# EAGLE design zgrzewarka (EAGLE 8.7.0)
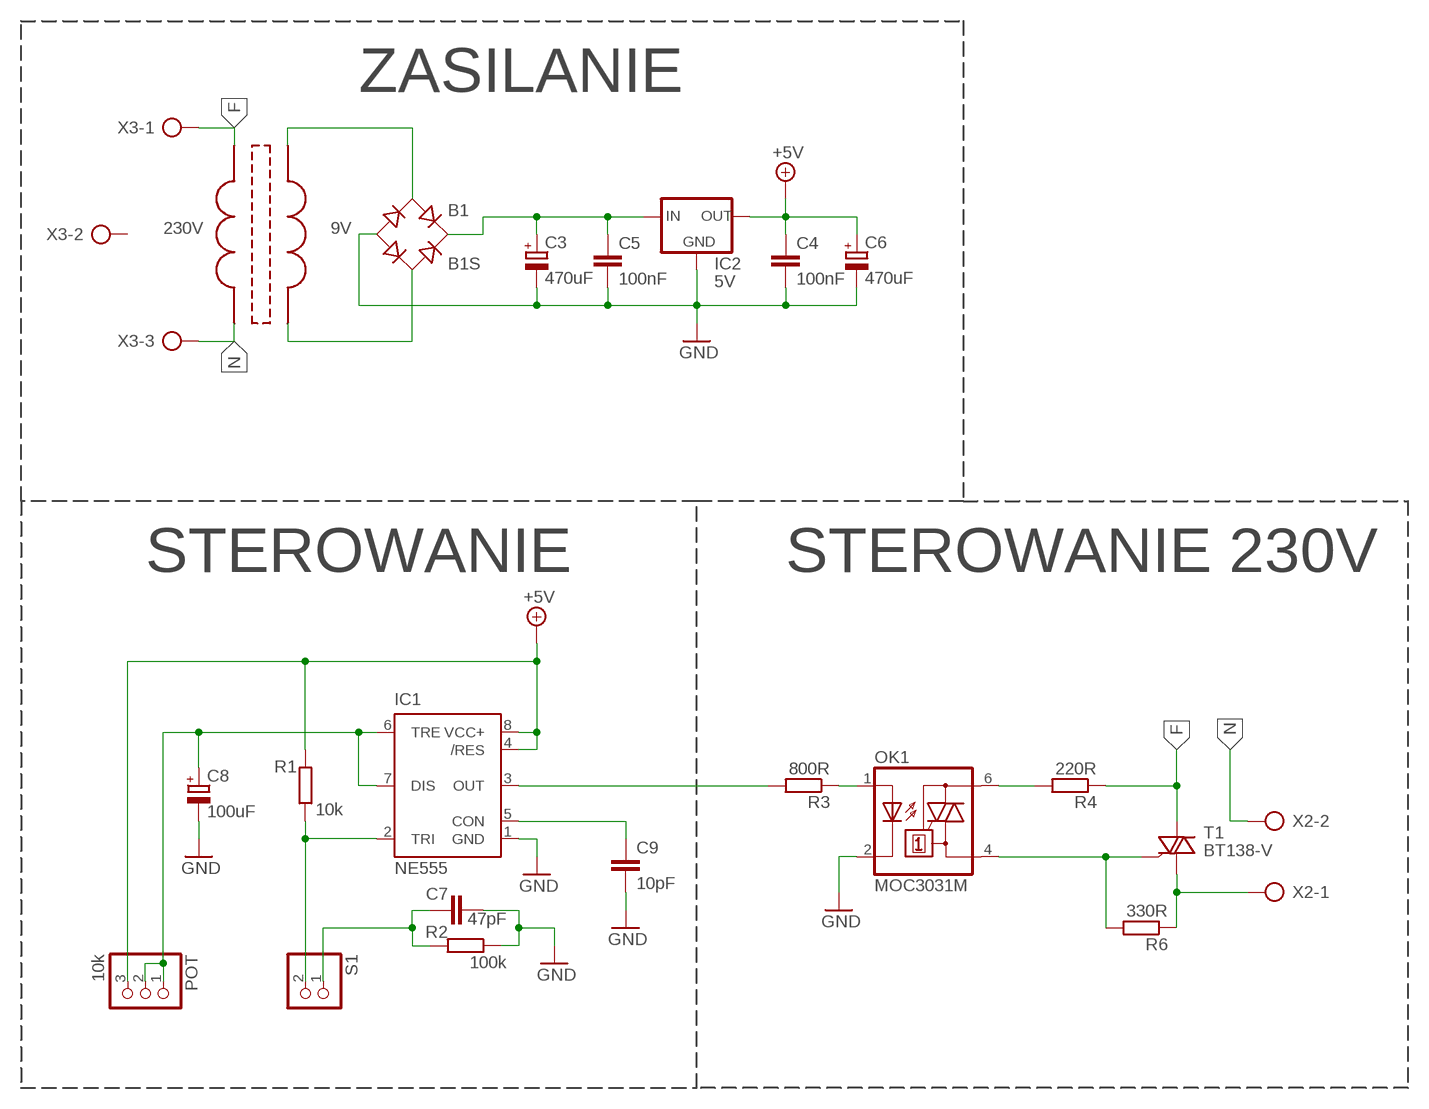
[diagram p0: schematic, sheet 1]

## Parts
B1  B1S  [MBS]
C3  470uF  C-EU-POL'''  [C5-8,5]
C4  100nF  C-EU050-045-075  [C50-45-75]
C5  100nF  C-EU050-045-075  [C50-45-75]
C6  470uF  C-EU-POL'''  [C5-8,5]
C7  47pF  C-EU050-045-075  [C50-45-75]
C8  100uF  C-EU-POL'''  [C5-8,5]
C9  10pF  C-EU050-045-075  [C50-45-75]
IC1  NE555  [DIL-08]
IC2  5V  78LXX  [78LXX]
OK1  MOC3031M  [DIL06]
POT  10k  PINHD-1X3  [1X03]
R1  10k  R-EU7  [204/7]
R2  100k  R-EU7  [204/7]
R3  800R  R-EU7  [204/7]
R4  220R  R-EU7  [204/7]
R6  330R  R-EU7  [204/7]
S1  PINHD-1X2  [1X02]
T1  BT138-V  [TO220BV]
U$1  TRAFO-9V  [OBUDOWA1]
X2  AK300/2  [AK300/2]
X3  AK300/3  [AK300/3]

## Nets
+5V: C4.P$1 C6.+ IC1.4(/RES) IC1.8(VCC+) IC2.OUT POT.3 R1.P$2
F: R4.P$1 T1.T2(A2) U$1.230V-1 X3.1
GND: B1.- C3.- C4.P$2 C5.P$2 C6.- C7.P$2 C8.- C9.P$2 IC1.1(GND) IC2.GND OK1.2(C) R2.P$1
N: U$1.230V-2 X2.2 X3.3
N$3: B1.AC1 U$1.9V-1
N$4: B1.AC2 U$1.9V-2
N$5: C9.P$1 IC1.5(CON)
N$6: B1.+ C3.+ C5.P$1 IC2.IN
N$7: IC1.2(TRI) R1.P$1 S1.2
N$8: IC1.3(OUT) R3.P$2
N$9: C7.P$1 R2.P$2 S1.1
N$10: OK1.1(A) R3.P$1
N$12: C8.+ IC1.6(TRE) IC1.7(DIS) POT.1 POT.2
N$13: OK1.6(A2) R4.P$2
N$14: OK1.4(A1) R6.P$2 T1.G
N$16: R6.P$1 T1.T1(A1) X2.1
Unconnected: X3.2

## Notes on the sheet
- ZASILANIE
- STEROWANIE | STEROWANIE 230V

## Library data of the parts
B1 = rectifier:B*S: Surface Mount Glass Passivated Bridge Rectifiers Source: Comchip Bridge Rectifiers B05S-G_B10S-G.pdf
C3 C6 C8 = RCL!:C-EU-POL
C4 C5 C7 C9 = RCL!:C-EU
IC1 = st-microelectronics:NE555: General purpose bipolar Timer; MF: Arrow Electronics; MPN: NE555N; OC_FARNELL: 1467742; OC_NEWARK: 89K1486
IC2 = v-reg:78LXX: VOLTAGE REGULATOR
OK1 = optocoupler:MOC30*: 6-Pin DIP Zero-Cross Optoisolators Triac Driver Output (250/400 Volt Peak) Source: Data sheet <http://www.fairchildsemi.com/ds/MO/MOC3031M.pdf> The old path of data sheet not more available 2013-05-06.; MF: FAIRCHILD SEMICONDUCTOR; MPN: MOC3031M; OC_FARNELL: 9875964; OC_NEWARK: 78K6089
POT = pinhead:PINHD-1X3: PIN HEADER
R1-R4 R6 = RCL!:R-EU
S1 = pinhead:PINHD-1X2: PIN HEADER
T1 = triac:BT138: TRIAC Source: http://www.semiconductors.philips.com BT138_SERIES_2.pdf
U$1 = trafo:TRAFO-9V
X2 = con-ptr500:AK300/2: CONNECTOR; OC_FARNELL: unknown; OC_NEWARK: unknown
X3 = con-ptr500:AK300/3: CONNECTOR; OC_FARNELL: unknown; OC_NEWARK: unknown

## Board
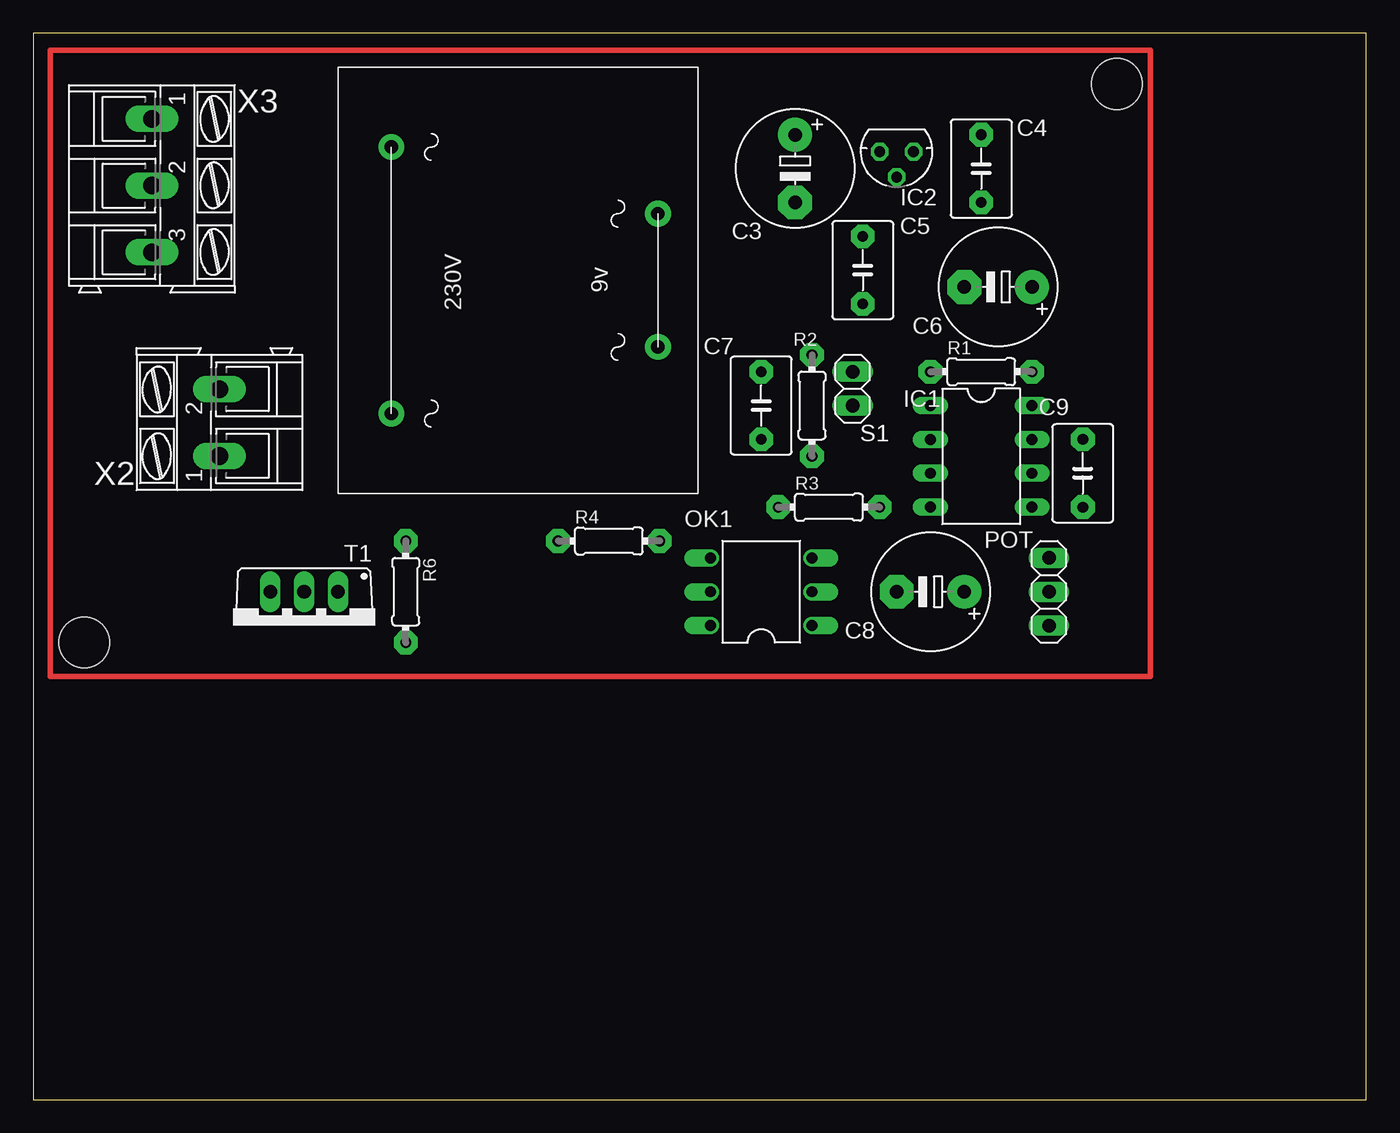
[diagram p1: board, top side]
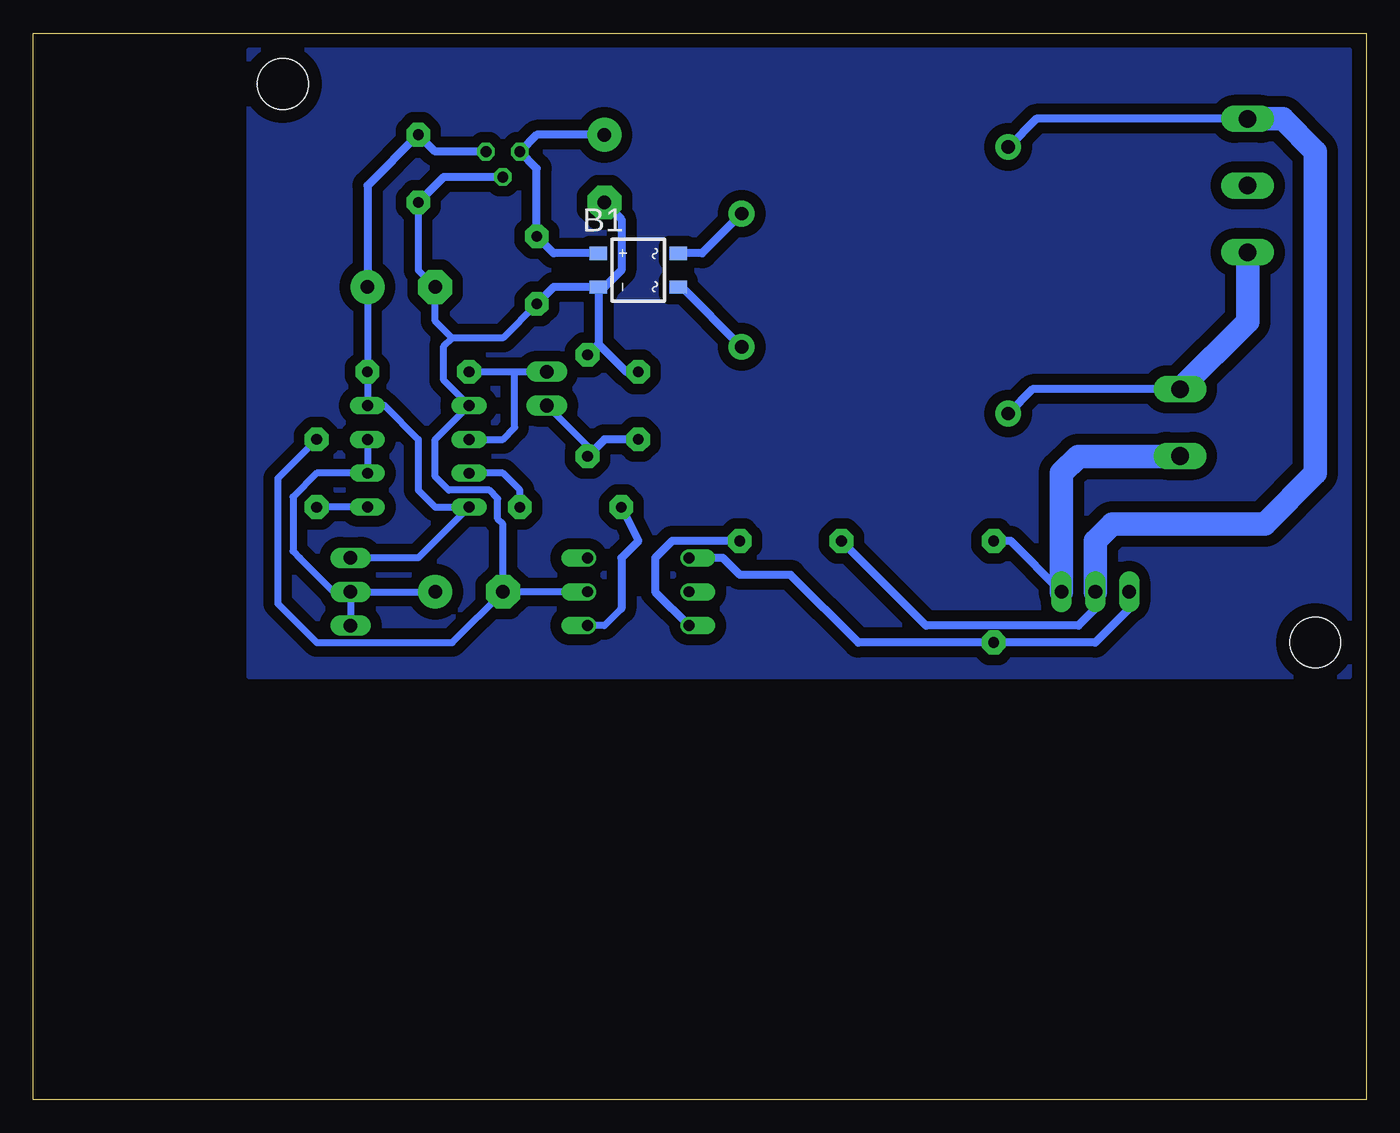
[diagram p2: board, bottom side, seen from below]

Size 100 x 80 mm. Coordinates in mm from the lower left corner, seen from the top.
Outline: 0,0 100,0 100,80 0,80 0,0
Copper layers (1*16): Top 0.035mm / dielectric 1.5mm / Bottom 0.035mm
Design rules "default": minimum track width 6mil, minimum drill 0.35mm, track to track 6mil, track to pad 6mil, pad to pad 6mil, via to via 6mil, smd to smd 6mil, copper to edge 40mil, drill to drill 6mil, minimum pad ring 10mil, minimum via ring 8mil, stop-mask expansion 4mil, vias tented up to drill 0mil, thermal gap 10mil
Holes 3.81 mm at 3.81,34.29 81.28,76.2

### Footprints (pad centres in the part's own frame; a part is rotated, then mirrored left to right if it is on the bottom)
MBS = smd 1 x 1.3: + -1.27,-3; - 1.27,-3; AC1 -1.27,3; AC2 1.27,3
C5-8,5 = drill 1.016 pad 2.54: + -2.54,0 | drill 1.016 pad 2.54 octagon: - 2.54,0
C50-45-75 = drill 0.8 pad 1.778 octagon: P$1 -2.54,0; P$2 2.54,0
DIL-08 = drill 0.813 long: 1 -3.81,-3.81; 2 -1.27,-3.81; 3 1.27,-3.81; 4 3.81,-3.81; 5 3.81,3.81; 6 1.27,3.81; 7 -1.27,3.81; 8 -3.81,3.81
78LXX = drill 0.813 octagon: GND 0,1.905; IN 1.27,0; OUT -1.27,0
DIL06 = drill 0.813 offset: 1 -2.54,-3.81; 2 0,-3.81; 3 2.54,-3.81; 4 2.54,3.81; 5 0,3.81; 6 -2.54,3.81
1X03 = drill 1.016 long: 1 -2.54,0; 2 0,0; 3 2.54,0
204/7 = drill 0.8 pad 1.778 octagon: P$1 -3.81,0; P$2 3.81,0
1X02 = drill 1.016 long: 1 -1.27,0; 2 1.27,0
TO220BV = drill 1.016 long: G 2.54,-2.54; T1 -2.54,-2.54; T2 0,-2.54
OBUDOWA1 = drill 1 pad 1.93: 9V-1 11,24; 9V-2 21,24; 230V-1 6,4; 230V-2 26,4
AK300/2 = drill 1.321 long: 1 -2.515,0; 2 2.489,0
AK300/3 = drill 1.321 long: 1 -5.004,0; 2 0,0; 3 5.004,0

### Placement (x,y rotation side)
B1  54.61,62.23 270 bottom
C3  57.15,69.85 270 top
C4  71.12,69.85 270 top
C5  62.23,62.23 270 top
C6  72.39,60.96 180 top
C7  54.61,52.07 90 top
C8  67.31,38.1 180 top
C9  78.74,46.99 90 top
IC1  71.12,48.26 270 top
IC2  64.77,71.12 180 top
OK1  54.61,38.1 90 top
POT  76.2,38.1 90 top
R1  71.12,54.61 0 top
R2  58.42,52.07 270 top
R3  59.69,44.45 0 top
R4  43.18,41.91 0 top
R6  27.94,38.1 270 top
S1  61.47,53.34 90 top
T1  20.32,35.56 180 top
U$1  22.86,77.47 270 top
X2  13.97,50.8 90 top
X3  8.89,68.58 270 top

### Tracks (layer width: path | path; a pad name or v marks a point on that pad's centre or on a via)
+5V
  Bottom 0.508: C6.+ R1.P$2 IC1.8 73.66,52.07 71.12,49.53 71.12,45.72 69.85,44.45 IC1.4 71.12,40.64 POT.3
  Bottom 0.61: IC2.OUT 69.85,71.12 C4.P$1 74.93,68.58 C6.+
F
  Bottom 0.61: X3.1 24.75,73.58 U$1.230V-1 | T1.T2 20.32,36.83 21.59,35.56 33.02,35.56 R4.P$1
  Bottom 1.778: X3.1 6.27,73.58 3.81,71.12 3.81,46.99 7.62,43.18 19.05,43.18 20.32,41.91 T1.T2
GND
  Bottom 0.508: C5.P$2 64.77,57.15 68.58,57.15 | C4.P$2 71.12,62.23 C6.- 69.85,58.42 68.58,57.15 | OK1.2 C8.- | C8.- 64.77,43.18 65.15,43.56 65.15,45.09 65.79,45.72 68.83,45.72 69.85,46.74 69.85,49.53 IC1.1 69.22,53.98 69.22,56.52 68.58,57.15 | C8.- 68.58,34.29 78.74,34.29 81.66,37.21 81.66,46.61 C9.P$2
  Bottom 0.61: IC2.GND 69.22,69.22 C4.P$2 | C3.- 55.88,66.04 55.88,62.23 57.15,60.96 B1.- | B1.- 60.96,60.96 C5.P$2 | B1.- 57.61,56.69 | 57.61,56.69 R2.P$1 | C7.P$2 55.53,54.61 57.61,56.69
N
  Bottom 0.61: X2.2 25.04,53.29 U$1.230V-2
  Bottom 1.778: X2.2 8.89,58.37 X3.3
N$1
  pour Bottom (isolate 0.813): 1.27,78.74 83.82,78.74 83.82,31.75 1.27,31.75
N$2
  Top 0.406: 1.27,78.74 83.82,78.74 83.82,31.75 1.27,31.75 1.27,78.74
N$3
  Bottom 0.61: U$1.9V-1 49.83,63.5 B1.AC1
N$4
  Bottom 0.61: U$1.9V-2 51.35,60.96 B1.AC2
N$5
  Bottom 0.508: IC1.5 C9.P$1
N$6
  Bottom 0.61: C3.+ 62.23,72.39 IC2.IN 62.23,69.85 C5.P$1 60.96,63.5 B1.+
N$7
  Bottom 0.508: R1.P$1 63.88,54.61 | 63.88,54.61 S1.2 | IC1.2 64.77,49.53 63.88,50.42 63.88,54.61
N$8
  Bottom 0.508: R3.P$2 63.5,45.72 64.77,46.99 IC1.3
N$9
  Bottom 0.508: S1.1 58.42,49.02 R2.P$2
  Bottom 0.61: C7.P$1 57.15,49.53 R2.P$2
N$10
  Bottom 0.508: 55.88,36.83 57.15,35.56 OK1.1
  Bottom 0.61: R3.P$1 54.61,41.91 55.88,40.64 55.88,36.83
N$12
  Bottom 0.508: POT.2 POT.1 | POT.2 C8.+ | POT.2 77.47,38.1 80.01,40.64 80.52,41.15 80.52,45.21 78.74,46.99 IC1.6 IC1.7
N$13
  Bottom 0.61: R4.P$2 52.07,41.91 53.34,40.64 53.34,38.1 OK1.6
N$14
  Bottom 0.152: R6.P$2 20.32,34.29
  Bottom 0.61: OK1.4 48.26,40.64 46.99,39.37 43.18,39.37 38.1,34.29 20.32,34.29 17.78,36.83 T1.G
N$16
  Bottom 0.61: T1.T1 26.67,41.91 R6.P$1
  Bottom 1.778: X2.1 13.99,48.26 21.59,48.26 22.86,46.99 T1.T1